# Altium schematic sheet 11_Temp.SchDoc: Level converters
size A3; Organization: Lime Microsystems; Address1: Surrey Tech Centre; Address2: Guildford GU2 7YG; Address3: Surrey; Address4: United Kingdom; Revision: v1.1; SheetNumber: 12; SheetTotal: 12
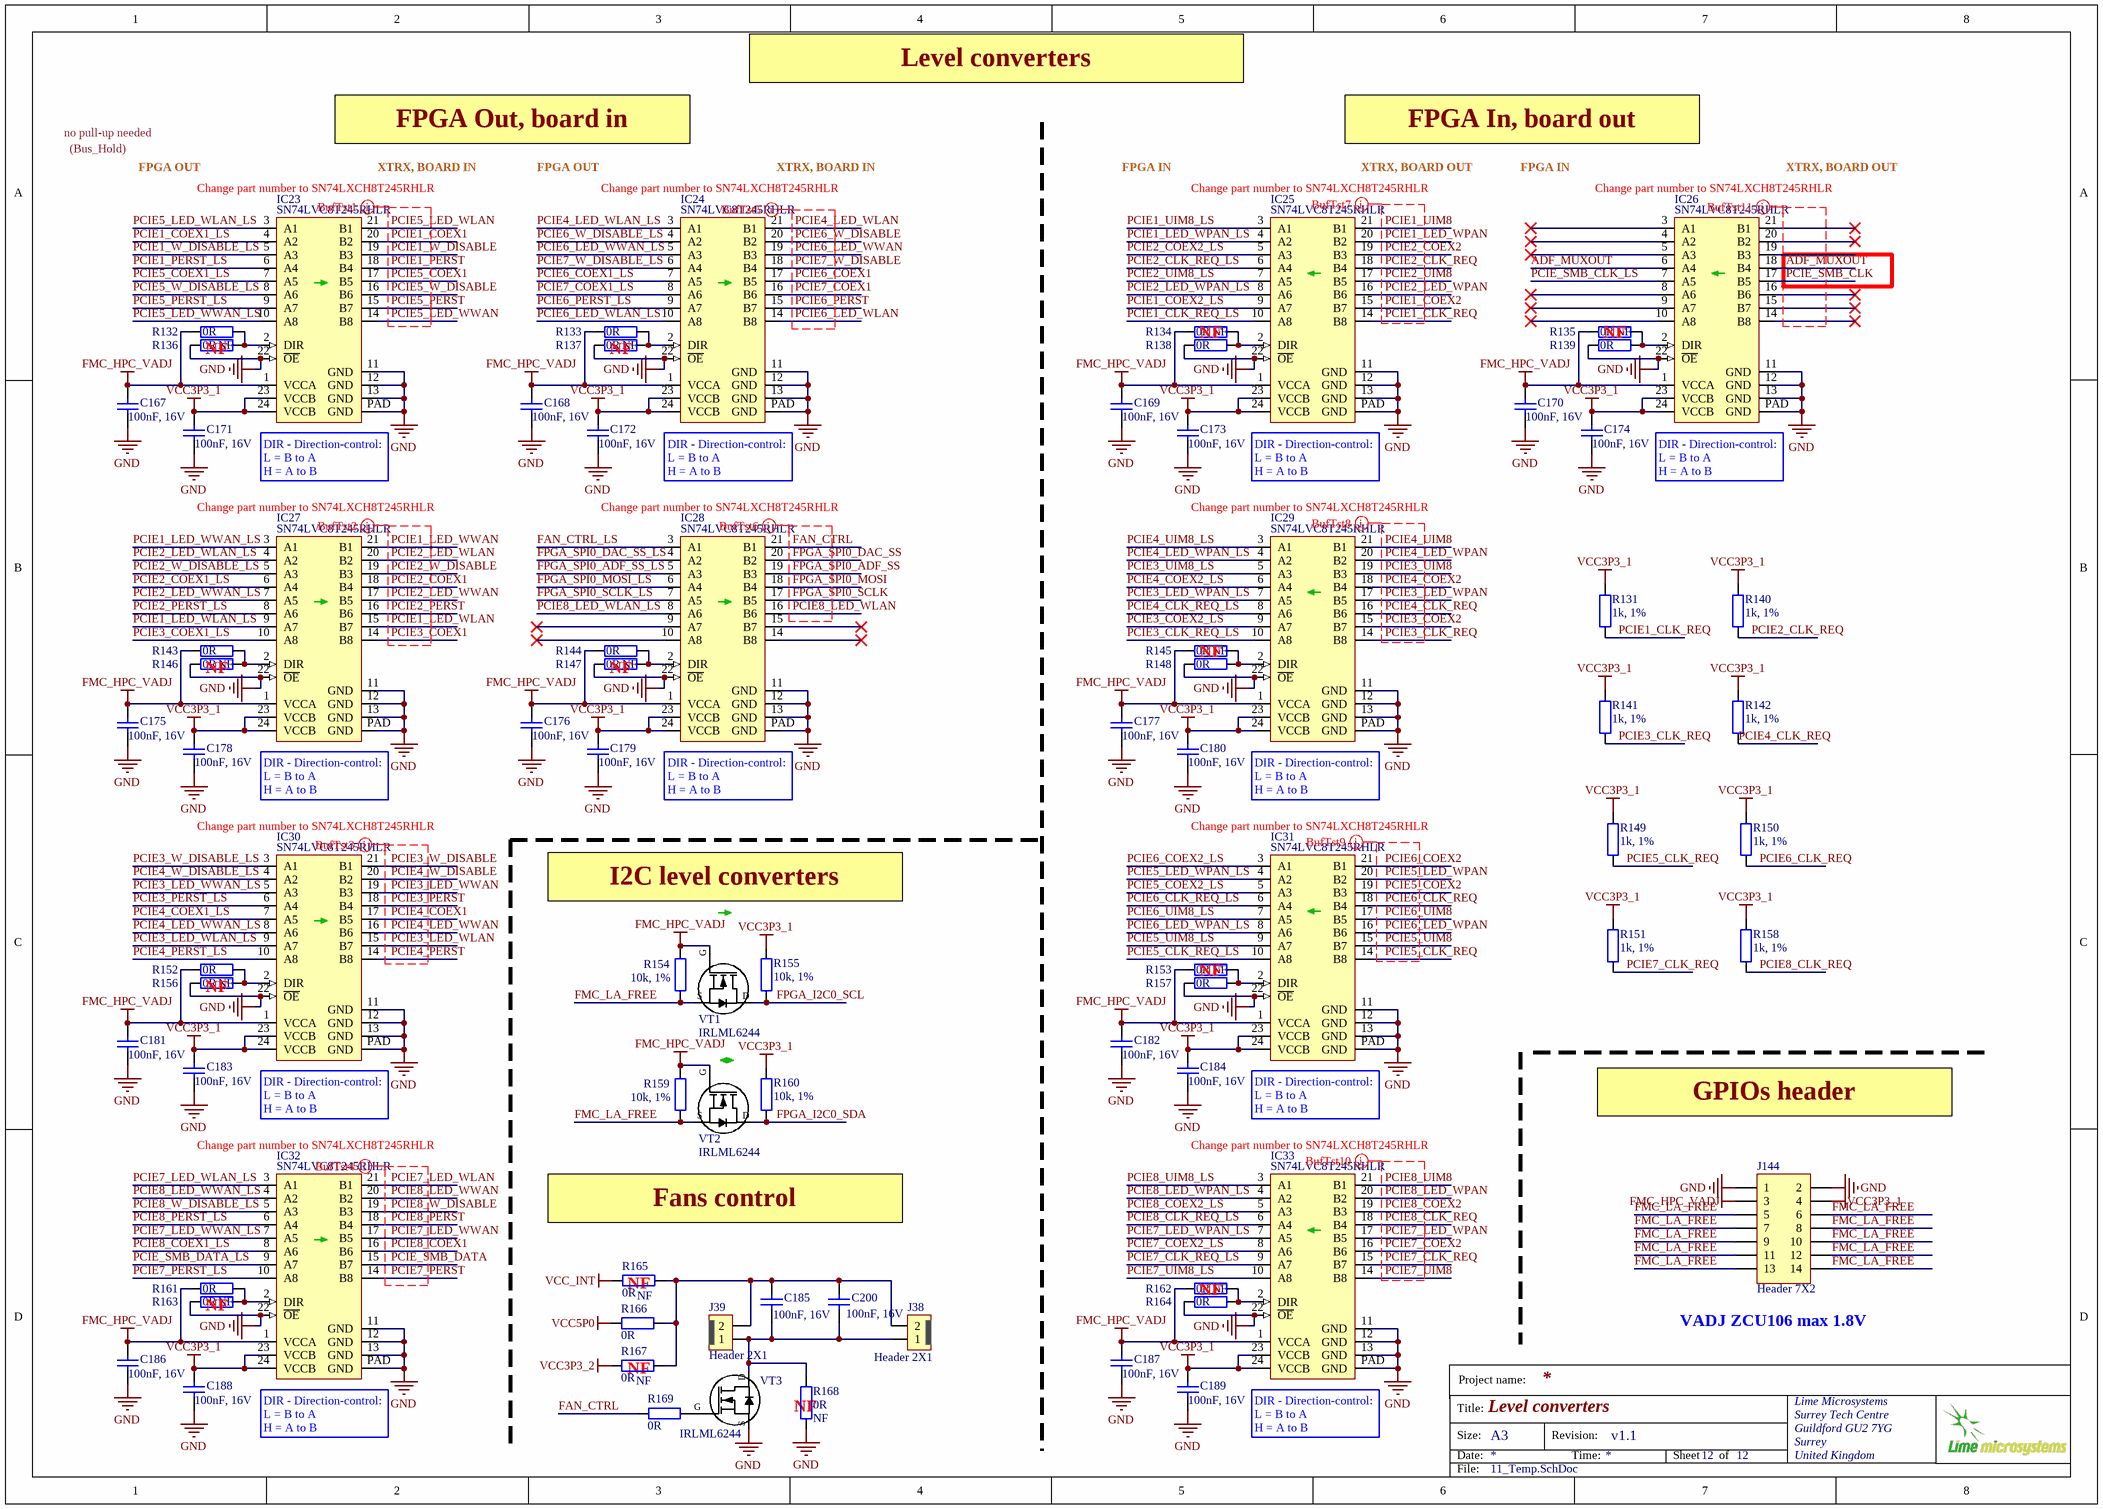
[diagram p0: 11_Temp.SchDoc]

## Parts
C167  100nF, 16V  [CAP0402]
C168  100nF, 16V  [CAP0402]
C169  100nF, 16V  [CAP0402]
C170  100nF, 16V  [CAP0402]
C171  100nF, 16V  [CAP0402]
C172  100nF, 16V  [CAP0402]
C173  100nF, 16V  [CAP0402]
C174  100nF, 16V  [CAP0402]
C175  100nF, 16V  [CAP0402]
C176  100nF, 16V  [CAP0402]
C177  100nF, 16V  [CAP0402]
C178  100nF, 16V  [CAP0402]
C179  100nF, 16V  [CAP0402]
C180  100nF, 16V  [CAP0402]
C181  100nF, 16V  [CAP0402]
C182  100nF, 16V  [CAP0402]
C183  100nF, 16V  [CAP0402]
C184  100nF, 16V  [CAP0402]
C185  100nF, 16V  [CAP0402]
C186  100nF, 16V  [CAP0402]
C187  100nF, 16V  [CAP0402]
C188  100nF, 16V  [CAP0402]
C189  100nF, 16V  [CAP0402]
C200  100nF, 16V  [CAP0402]
IC23  SN74LVC8T245RHLR  [SN74LVC8T245RHLR_24-VQFN_LVL_SHIFTER]
IC24  SN74LVC8T245RHLR  [SN74LVC8T245RHLR_24-VQFN_LVL_SHIFTER]
IC25  SN74LVC8T245RHLR  [SN74LVC8T245RHLR_24-VQFN_LVL_SHIFTER]
IC26  SN74LVC8T245RHLR  [SN74LVC8T245RHLR_24-VQFN_LVL_SHIFTER]
IC27  SN74LVC8T245RHLR  [SN74LVC8T245RHLR_24-VQFN_LVL_SHIFTER]
IC28  SN74LVC8T245RHLR  [SN74LVC8T245RHLR_24-VQFN_LVL_SHIFTER]
IC29  SN74LVC8T245RHLR  [SN74LVC8T245RHLR_24-VQFN_LVL_SHIFTER]
IC30  SN74LVC8T245RHLR  [SN74LVC8T245RHLR_24-VQFN_LVL_SHIFTER]
IC31  SN74LVC8T245RHLR  [SN74LVC8T245RHLR_24-VQFN_LVL_SHIFTER]
IC32  SN74LVC8T245RHLR  [SN74LVC8T245RHLR_24-VQFN_LVL_SHIFTER]
IC33  SN74LVC8T245RHLR  [SN74LVC8T245RHLR_24-VQFN_LVL_SHIFTER]
J38  Header 2X1  [Header1x2_TH_LOCKING]
J39  Header 2X1  [Header1x2_TH_LOCKING]
J144  Header 7X2  [Header7x2_TH]
R131  1k, 1%  [RES0402]
R132  0R  [RES0402]
R133  0R  [RES0402]
R134  0R  Assembly Info: NF  [RES0402]
R135  0R  Assembly Info: NF  [RES0402]
R136  0R  Assembly Info: NF  [RES0402]
R137  0R  Assembly Info: NF  [RES0402]
R138  0R  [RES0402]
R139  0R  [RES0402]
R140  1k, 1%  [RES0402]
R141  1k, 1%  [RES0402]
R142  1k, 1%  [RES0402]
R143  0R  [RES0402]
R144  0R  [RES0402]
R145  0R  Assembly Info: NF  [RES0402]
R146  0R  Assembly Info: NF  [RES0402]
R147  0R  Assembly Info: NF  [RES0402]
R148  0R  [RES0402]
R149  1k, 1%  [RES0402]
R150  1k, 1%  [RES0402]
R151  1k, 1%  [RES0402]
R152  0R  [RES0402]
R153  0R  Assembly Info: NF  [RES0402]
R154  10k, 1%  [RES0402]
R155  10k, 1%  [RES0402]
R156  0R  Assembly Info: NF  [RES0402]
R157  0R  [RES0402]
R158  1k, 1%  [RES0402]
R159  10k, 1%  [RES0402]
R160  10k, 1%  [RES0402]
R161  0R  [RES0402]
R162  0R  Assembly Info: NF  [RES0402]
R163  0R  Assembly Info: NF  [RES0402]
R164  0R  [RES0402]
R165  0R  Assembly Info: NF  [RES0402]
R166  0R  [RES0402]
R167  0R  Assembly Info: NF  [RES0402]
R168  0R  Assembly Info: NF  [RES0402]
R169  0R  [RES0402]
VT1  IRLML6244  [SOT23-3]
VT2  IRLML6244  [SOT23-3]
VT3  IRLML6244  [SOT23-3]

## Nets
FMC_HPC_VADJ: C167.2 C168.2 C169.2 C170.2 C175.2 C176.2 C177.2 C181.2 C182.2 C186.2 C187.2 IC23.1(VCCA) IC24.1(VCCA) IC25.1(VCCA) IC26.1(VCCA) IC27.1(VCCA) IC28.1(VCCA) IC29.1(VCCA) IC30.1(VCCA) IC31.1(VCCA) IC32.1(VCCA) IC33.1(VCCA) J144.3 R132.1 R133.1 R134.1 R135.1 R143.1 R144.1 R145.1 R152.1 R153.1 R154.1 R159.1 R161.1 R162.1 VT1.G VT2.G
GND: C167.1 C168.1 C169.1 C170.1 C171.1 C172.1 C173.1 C174.1 C175.1 C176.1 C177.1 C178.1 C179.1 C180.1 C181.1 C182.1 C183.1 C184.1 C186.1 C187.1 C188.1 C189.1 IC23.11(GND) IC23.12(GND) IC23.13(GND) IC23.22(~{OE}) IC23.PAD(GND) IC24.11(GND) IC24.12(GND) IC24.13(GND) IC24.22(~{OE}) IC24.PAD(GND) IC25.11(GND) IC25.12(GND) IC25.13(GND) IC25.22(~{OE}) IC25.PAD(GND) IC26.11(GND) IC26.12(GND) IC26.13(GND) IC26.22(~{OE}) IC26.PAD(GND) IC27.11(GND) IC27.12(GND) IC27.13(GND) IC27.22(~{OE}) IC27.PAD(GND) IC28.11(GND) IC28.12(GND) IC28.13(GND) IC28.22(~{OE}) IC28.PAD(GND) IC29.11(GND) IC29.12(GND) IC29.13(GND) IC29.22(~{OE}) IC29.PAD(GND) IC30.11(GND) IC30.12(GND) IC30.13(GND) IC30.22(~{OE}) IC30.PAD(GND) IC31.11(GND) IC31.12(GND) IC31.13(GND) IC31.22(~{OE}) IC31.PAD(GND) IC32.11(GND) IC32.12(GND) IC32.13(GND) IC32.22(~{OE}) IC32.PAD(GND) IC33.11(GND) IC33.12(GND) IC33.13(GND) IC33.22(~{OE}) IC33.PAD(GND) J144.1 J144.2 R136.1 R137.1 R138.1 R139.1 R146.1 R147.1 R148.1 R156.1 R157.1 R163.1 R164.1 R168.1 VT3.S
VCC3P3_1: C171.2 C172.2 C173.2 C174.2 C178.2 C179.2 C180.2 C183.2 C184.2 C188.2 C189.2 IC23.23(VCCB) IC23.24(VCCB) IC24.23(VCCB) IC24.24(VCCB) IC25.23(VCCB) IC25.24(VCCB) IC26.23(VCCB) IC26.24(VCCB) IC27.23(VCCB) IC27.24(VCCB) IC28.23(VCCB) IC28.24(VCCB) IC29.23(VCCB) IC29.24(VCCB) IC30.23(VCCB) IC30.24(VCCB) IC31.23(VCCB) IC31.24(VCCB) IC32.23(VCCB) IC32.24(VCCB) IC33.23(VCCB) IC33.24(VCCB) J144.4 R131.2 R140.2 R141.2 R142.2 R149.2 R150.2 R151.2 R155.1 R158.2 R160.1
VCC3P3_2: R167.1
VCC5P0: R166.1
VCC_INT: R165.1
ADF_MUXOUT: IC26.6(A4) IC26.18(B4)
FAN_CTRL: IC28.21(B1) R169.1
FAN_CTRL_LS: IC28.3(A1)
FMC_LA_FREE: J144.5 J144.6 J144.7 J144.8 J144.9 J144.10 J144.11 J144.12 J144.13 J144.14 R154.2 R159.2 VT1.S VT2.S
FPGA_I2C0_SCL: R155.2 VT1.D
FPGA_I2C0_SDA: R160.2 VT2.D
FPGA_SPI0_ADF_SS: IC28.19(B3)
FPGA_SPI0_ADF_SS_LS: IC28.5(A3)
FPGA_SPI0_DAC_SS: IC28.20(B2)
FPGA_SPI0_DAC_SS_LS: IC28.4(A2)
FPGA_SPI0_MOSI: IC28.18(B4)
FPGA_SPI0_MOSI_LS: IC28.6(A4)
FPGA_SPI0_SCLK: IC28.17(B5)
FPGA_SPI0_SCLK_LS: IC28.7(A5)
PCIE1_CLK_REQ: IC25.14(B8) R131.1
PCIE1_CLK_REQ_LS: IC25.10(A8)
PCIE1_COEX1: IC23.20(B2)
PCIE1_COEX1_LS: IC23.4(A2)
PCIE1_COEX2: IC25.15(B7)
PCIE1_COEX2_LS: IC25.9(A7)
PCIE1_LED_WLAN: IC27.15(B7)
PCIE1_LED_WLAN_LS: IC27.9(A7)
PCIE1_LED_WPAN: IC25.20(B2)
PCIE1_LED_WPAN_LS: IC25.4(A2)
PCIE1_LED_WWAN: IC27.21(B1)
PCIE1_LED_WWAN_LS: IC27.3(A1)
PCIE1_PERST: IC23.18(B4)
PCIE1_PERST_LS: IC23.6(A4)
PCIE1_UIM8: IC25.21(B1)
PCIE1_UIM8_LS: IC25.3(A1)
PCIE1_W_DISABLE: IC23.19(B3)
PCIE1_W_DISABLE_LS: IC23.5(A3)
PCIE2_CLK_REQ: IC25.18(B4) R140.1
PCIE2_CLK_REQ_LS: IC25.6(A4)
PCIE2_COEX1: IC27.18(B4)
PCIE2_COEX1_LS: IC27.6(A4)
PCIE2_COEX2: IC25.19(B3)
PCIE2_COEX2_LS: IC25.5(A3)
PCIE2_LED_WLAN: IC27.20(B2)
PCIE2_LED_WLAN_LS: IC27.4(A2)
PCIE2_LED_WPAN: IC25.16(B6)
PCIE2_LED_WPAN_LS: IC25.8(A6)
PCIE2_LED_WWAN: IC27.17(B5)
PCIE2_LED_WWAN_LS: IC27.7(A5)
PCIE2_PERST: IC27.16(B6)
PCIE2_PERST_LS: IC27.8(A6)
PCIE2_UIM8: IC25.17(B5)
PCIE2_UIM8_LS: IC25.7(A5)
PCIE2_W_DISABLE: IC27.19(B3)
PCIE2_W_DISABLE_LS: IC27.5(A3)
PCIE3_CLK_REQ: IC29.14(B8) R141.1
PCIE3_CLK_REQ_LS: IC29.10(A8)
PCIE3_COEX1: IC27.14(B8)
PCIE3_COEX1_LS: IC27.10(A8)
PCIE3_COEX2: IC29.15(B7)
PCIE3_COEX2_LS: IC29.9(A7)
PCIE3_LED_WLAN: IC30.15(B7)
PCIE3_LED_WLAN_LS: IC30.9(A7)
PCIE3_LED_WPAN: IC29.17(B5)
PCIE3_LED_WPAN_LS: IC29.7(A5)
PCIE3_LED_WWAN: IC30.19(B3)
PCIE3_LED_WWAN_LS: IC30.5(A3)
PCIE3_PERST: IC30.18(B4)
PCIE3_PERST_LS: IC30.6(A4)
PCIE3_UIM8: IC29.19(B3)
PCIE3_UIM8_LS: IC29.5(A3)
PCIE3_W_DISABLE: IC30.21(B1)
PCIE3_W_DISABLE_LS: IC30.3(A1)
PCIE4_CLK_REQ: IC29.16(B6) R142.1
PCIE4_CLK_REQ_LS: IC29.8(A6)
PCIE4_COEX1: IC30.17(B5)
PCIE4_COEX1_LS: IC30.7(A5)
PCIE4_COEX2: IC29.18(B4)
PCIE4_COEX2_LS: IC29.6(A4)
PCIE4_LED_WLAN: IC24.21(B1)
PCIE4_LED_WLAN_LS: IC24.3(A1)
PCIE4_LED_WPAN: IC29.20(B2)
PCIE4_LED_WPAN_LS: IC29.4(A2)
PCIE4_LED_WWAN: IC30.16(B6)
PCIE4_LED_WWAN_LS: IC30.8(A6)
PCIE4_PERST: IC30.14(B8)
PCIE4_PERST_LS: IC30.10(A8)
PCIE4_UIM8: IC29.21(B1)
PCIE4_UIM8_LS: IC29.3(A1)
PCIE4_W_DISABLE: IC30.20(B2)
PCIE4_W_DISABLE_LS: IC30.4(A2)
PCIE5_CLK_REQ: IC31.14(B8) R149.1
PCIE5_CLK_REQ_LS: IC31.10(A8)
PCIE5_COEX1: IC23.17(B5)
PCIE5_COEX1_LS: IC23.7(A5)
PCIE5_COEX2: IC31.19(B3)
PCIE5_COEX2_LS: IC31.5(A3)
PCIE5_LED_WLAN: IC23.21(B1)
PCIE5_LED_WLAN_LS: IC23.3(A1)
PCIE5_LED_WPAN: IC31.20(B2)
PCIE5_LED_WPAN_LS: IC31.4(A2)
PCIE5_LED_WWAN: IC23.14(B8)
PCIE5_LED_WWAN_LS: IC23.10(A8)
PCIE5_PERST: IC23.15(B7)
PCIE5_PERST_LS: IC23.9(A7)
PCIE5_UIM8: IC31.15(B7)
PCIE5_UIM8_LS: IC31.9(A7)
PCIE5_W_DISABLE: IC23.16(B6)
PCIE5_W_DISABLE_LS: IC23.8(A6)
PCIE6_CLK_REQ: IC31.18(B4) R150.1
PCIE6_CLK_REQ_LS: IC31.6(A4)
PCIE6_COEX1: IC24.17(B5)
PCIE6_COEX1_LS: IC24.7(A5)
PCIE6_COEX2: IC31.21(B1)
PCIE6_COEX2_LS: IC31.3(A1)
PCIE6_LED_WLAN: IC24.14(B8)
PCIE6_LED_WLAN_LS: IC24.10(A8)
PCIE6_LED_WPAN: IC31.16(B6)
PCIE6_LED_WPAN_LS: IC31.8(A6)
PCIE6_LED_WWAN: IC24.19(B3)
PCIE6_LED_WWAN_LS: IC24.5(A3)
PCIE6_PERST: IC24.15(B7)
PCIE6_PERST_LS: IC24.9(A7)
PCIE6_UIM8: IC31.17(B5)
PCIE6_UIM8_LS: IC31.7(A5)
PCIE6_W_DISABLE: IC24.20(B2)
PCIE6_W_DISABLE_LS: IC24.4(A2)
PCIE7_CLK_REQ: IC33.15(B7) R151.1
PCIE7_CLK_REQ_LS: IC33.9(A7)
PCIE7_COEX1: IC24.16(B6)
PCIE7_COEX1_LS: IC24.8(A6)
PCIE7_COEX2: IC33.16(B6)
PCIE7_COEX2_LS: IC33.8(A6)
PCIE7_LED_WLAN: IC32.21(B1)
PCIE7_LED_WLAN_LS: IC32.3(A1)
PCIE7_LED_WPAN: IC33.17(B5)
PCIE7_LED_WPAN_LS: IC33.7(A5)
PCIE7_LED_WWAN: IC32.17(B5)
PCIE7_LED_WWAN_LS: IC32.7(A5)
PCIE7_PERST: IC32.14(B8)
PCIE7_PERST_LS: IC32.10(A8)
PCIE7_UIM8: IC33.14(B8)
PCIE7_UIM8_LS: IC33.10(A8)
PCIE7_W_DISABLE: IC24.18(B4)
PCIE7_W_DISABLE_LS: IC24.6(A4)
PCIE8_CLK_REQ: IC33.18(B4) R158.1
PCIE8_CLK_REQ_LS: IC33.6(A4)
PCIE8_COEX1: IC32.16(B6)
PCIE8_COEX1_LS: IC32.8(A6)
PCIE8_COEX2: IC33.19(B3)
PCIE8_COEX2_LS: IC33.5(A3)
PCIE8_LED_WLAN: IC28.16(B6)
PCIE8_LED_WLAN_LS: IC28.8(A6)
PCIE8_LED_WPAN: IC33.20(B2)
PCIE8_LED_WPAN_LS: IC33.4(A2)
PCIE8_LED_WWAN: IC32.20(B2)
PCIE8_LED_WWAN_LS: IC32.4(A2)
PCIE8_PERST: IC32.18(B4)
PCIE8_PERST_LS: IC32.6(A4)
PCIE8_UIM8: IC33.21(B1)
PCIE8_UIM8_LS: IC33.3(A1)
PCIE8_W_DISABLE: IC32.19(B3)
PCIE8_W_DISABLE_LS: IC32.5(A3)
PCIE_SMB_CLK: IC26.17(B5)
PCIE_SMB_CLK_LS: IC26.7(A5)
PCIE_SMB_DATA: IC32.15(B7)
PCIE_SMB_DATA_LS: IC32.9(A7)
NetC185_1: C185.1 C200.1 J38.2 J39.2 R165.2 R166.2 R167.2
NetC185_2: C185.2 C200.2 J38.1 J39.1 R168.2 VT3.D
NetIC23_2: IC23.2(DIR) R132.2 R136.2
NetIC24_2: IC24.2(DIR) R133.2 R137.2
NetIC25_2: IC25.2(DIR) R134.2 R138.2
NetIC26_2: IC26.2(DIR) R135.2 R139.2
NetIC27_2: IC27.2(DIR) R143.2 R146.2
NetIC28_2: IC28.2(DIR) R144.2 R147.2
NetIC29_2: IC29.2(DIR) R145.2 R148.2
NetIC30_2: IC30.2(DIR) R152.2 R156.2
NetIC31_2: IC31.2(DIR) R153.2 R157.2
NetIC32_2: IC32.2(DIR) R161.2 R163.2
NetIC33_2: IC33.2(DIR) R162.2 R164.2
NetR169_2: R169.2 VT3.G

Not connected (* = marked no-connect by the designer): IC26 3(A1)* 4(A2)* 5(A3)* 8(A6)* 9(A7)* 10(A8)* 14(B8)* 15(B7)* 16(B6)* 19(B3) 20(B2)* 21(B1)*; IC28 9(A7)* 10(A8)* 14(B8)* 15(B7)*

## Layout directives
net class BufTst1: PCIE1_COEX1, PCIE1_PERST, PCIE1_W_DISABLE, PCIE5_COEX1, PCIE5_LED_WLAN, PCIE5_LED_WWAN, PCIE5_PERST, PCIE5_W_DISABLE
net class BufTst2: PCIE1_LED_WLAN, PCIE1_LED_WWAN, PCIE2_COEX1, PCIE2_LED_WLAN, PCIE2_LED_WWAN, PCIE2_PERST, PCIE2_W_DISABLE, PCIE3_COEX1
net class BufTst3: PCIE3_LED_WLAN, PCIE3_LED_WWAN, PCIE3_PERST, PCIE3_W_DISABLE, PCIE4_COEX1, PCIE4_LED_WWAN, PCIE4_PERST, PCIE4_W_DISABLE
net class BufTst4: PCIE7_LED_WLAN, PCIE7_LED_WWAN, PCIE7_PERST, PCIE8_COEX1, PCIE8_LED_WWAN, PCIE8_PERST, PCIE8_W_DISABLE, PCIE_SMB_DATA
net class BufTst6: FAN_CTRL, FPGA_SPI0_ADF_SS, FPGA_SPI0_DAC_SS, FPGA_SPI0_MOSI, FPGA_SPI0_SCLK, PCIE8_LED_WLAN
net class BufTst5: PCIE4_LED_WLAN, PCIE6_COEX1, PCIE6_LED_WLAN, PCIE6_LED_WWAN, PCIE6_PERST, PCIE6_W_DISABLE, PCIE7_COEX1, PCIE7_W_DISABLE
net class BufTst7: PCIE1_CLK_REQ, PCIE1_COEX2, PCIE1_LED_WPAN, PCIE1_UIM8, PCIE2_CLK_REQ, PCIE2_COEX2, PCIE2_LED_WPAN, PCIE2_UIM8
net class BufTst8: PCIE3_CLK_REQ, PCIE3_COEX2, PCIE3_LED_WPAN, PCIE3_UIM8, PCIE4_CLK_REQ, PCIE4_COEX2, PCIE4_LED_WPAN, PCIE4_UIM8
net class BufTst9: PCIE5_CLK_REQ, PCIE5_COEX2, PCIE5_LED_WPAN, PCIE5_UIM8, PCIE6_CLK_REQ, PCIE6_COEX2, PCIE6_LED_WPAN, PCIE6_UIM8
net class BufTst10: PCIE7_CLK_REQ, PCIE7_COEX2, PCIE7_LED_WPAN, PCIE7_UIM8, PCIE8_CLK_REQ, PCIE8_COEX2, PCIE8_LED_WPAN, PCIE8_UIM8
net class BufTst11: ADF_MUXOUT, PCIE_SMB_CLK

## Notes on the sheet
- Level converters
- no pull-up needed
- (Bus_Hold)
- FPGA OUT
- FPGA Out, board in
- XTRX, BOARD IN
- FPGA IN
- FPGA In, board out
- (near IC25) XTRX, BOARD OUT
- XTRX, BOARD OUT
- (near IC23) Change part number to SN74LXCH8T245RHLR
- (near IC24) Change part number to SN74LXCH8T245RHLR
- (near IC25) Change part number to SN74LXCH8T245RHLR
- (near IC26) Change part number to SN74LXCH8T245RHLR
- (near R136) NF
- (near R137) NF
- NF
- (near IC27) Change part number to SN74LXCH8T245RHLR
- (near IC23) DIR - Direction-control:
  L = B to A
  H = A to B
- (near IC28) Change part number to SN74LXCH8T245RHLR
- (near IC24) DIR - Direction-control:
  L = B to A
  H = A to B
- (near IC29) Change part number to SN74LXCH8T245RHLR
- (near IC25) DIR - Direction-control:
  L = B to A
  H = A to B
- (near IC26) DIR - Direction-control:
  L = B to A
  H = A to B
- (near R146) NF
- (near R147) NF
- (near IC30) Change part number to SN74LXCH8T245RHLR
- (near IC27) DIR - Direction-control:
  L = B to A
  H = A to B
- (near IC28) DIR - Direction-control:
  L = B to A
  H = A to B
- (near IC31) Change part number to SN74LXCH8T245RHLR
- (near IC29) DIR - Direction-control:
  L = B to A
  H = A to B
- I2C level converters
- (near R156) NF
- (near IC30) DIR - Direction-control:
  L = B to A
  H = A to B
- (near IC31) DIR - Direction-control:
  L = B to A
  H = A to B
- GPIOs header
- (near IC32) Change part number to SN74LXCH8T245RHLR
- (near IC33) Change part number to SN74LXCH8T245RHLR
- Fans control
- (near R163) NF
- (near R165) NF
- (near J144) VADJ ZCU106 max 1.8V
- (near R167) NF
- (near IC32) DIR - Direction-control:
  L = B to A
  H = A to B
- (near R168) NF
- (near IC33) DIR - Direction-control:
  L = B to A
  H = A to B
- Project name:
- Title:
- Size:
- Date:
- A3
- Revision:
- Time:
- Sheet
- of
- File:

## Library data of the parts
C167-C184 C186-C189 = Cap_0603: Manufacturer Part Number 1: GRM155R71C104KA88D; Part Description: 0.10µF ±10% 16V X7R Ceramic Capacitor -55°C ~ 125°C Surface Mount, MLCC 0402 (1005 Metric) 0.039" L x 0.020" W (1.00mm x 0.50mm); Brand: Murata Electronics; Tolerance: 10 %; Type: General Purpose MLCC; Capacitance: 0.1 uF; Temperature Coefficient / Code: +/- 15 %; Case Height: 0.5 mm; Case Length: 1 mm; Dielectric: X7R; Supplier 1: Mouser; Supplier Part Number 1: 81-GRM155R71C104KA88; Case Code - in: 0402; Manufacturer: Murata Electronics; Category: Multilayer Ceramic Capacitors MLCC - SMD/SMT; Voltage Rating DC: 16 V; Value: 100nF, 16V; Case Code - mm: 1005; Case Width: 0.5 mm; Maximum Operating Temperature: + 125 C; Minimum Operating Temperature: - 55 C; Minimum Order Quantity: 1; Operating Temperature Range: - 55 C to + 125 C; Package / Case: 0402 (1005 metric); Packaging: Reel; Product: General Type MLCCs; Product Category: Low & Medium Capacitance SMD Ceramic Chip Capacitors; Reeling: True; RoHS - Mouser: Y; RoHS: RoHS Compliant; Series: GRM; Standard Pack Qty: 10000; Termination Style: SMD/SMT
C185 C200 = Cap_0603: Manufacturer Part Number 1: GRM155R71C104KA88D; Part Description: 0.10µF ±10% 16V Ceramic Capacitor X7R 0402 (1005 Metric); Brand: Murata Electronics; Tolerance: 10 %; Type: General Purpose MLCC; Capacitance: 0.1 uF; Temperature Coefficient / Code: +/- 15 %; Case Height: 0.5 mm; Case Length: 1 mm; Dielectric: X7R; Supplier 1: Mouser; Supplier Part Number 1: 81-GRM155R71C104KA88; Case Code - in: 0402; Manufacturer: Murata Electronics; Category: Multilayer Ceramic Capacitors MLCC - SMD/SMT; Voltage Rating DC: 16 V; Value: 100nF, 16V; Manufacturer Part Number: GRM155R71C104KA88D; Case Code - mm: 1005; Case Width: 0.5 mm; Maximum Operating Temperature: + 125 C; Minimum Operating Temperature: - 55 C; Minimum Order Quantity: 1; Operating Temperature Range: - 55 C to + 125 C; Package / Case: 0402 (1005 metric); Packaging: Reel; Product: General Type MLCCs; Product Category: Low & Medium Capacitance SMD Ceramic Chip Capacitors; Reeling: True; RoHS - Mouser: Y; RoHS: RoHS Compliant; Series: GRM; Standard Pack Qty: 10000; Termination Style: SMD/SMT
IC23-IC33 = SN74LVC8T245RHLR_LVL_SHIFTER: Manufacturer: Texas Instruments; Part Description: Voltage Level Translator Bidirectional 1 Circuit 8 Channel  24-VQFN (5.5x3.5); Direction: Bidirectional; Number of Elements: 1; Propagation Delay: 4.3ns; Max Supply Voltage: 5.5V; Min Supply Voltage: 1.65V; Number of Inputs: 8; Output Current: 32mA; Logic Function: Translator; Turn-On Delay Time: 4.2ns; Data Rate: 500Mbps; Polarity: Non-Inverting; High Level Output Current: -32mA; Quiescent Current: 15uA; Supplier 1: Digi-Key; Manufacturer Part Number 1: SN74LVC8T245RHLR; Stock 1: 27446; Pricing 1: 1=1,38000, 10=1,23700, 100=0,96420, 500=0,79650 (USD); RoHS: Yes; Mount: Surface Mount; Case/Package: VQFN; Number of Pins: 24; Weight: 0.001767oz; Contact Plating: Gold; Min Operating Temperature: -40°C; Max Operating Temperature: 85°C; Packaging: Tape and Reel; Package Quantity: 1; Number of Channels: 8; Number of Bits: 8; Low Level Output Current: 32mA; Number of Outputs: 8; Nominal Supply Current: 15uA; Length: 5.65mm; Height: 0.95mm; Width: 3.65mm; Radiation Hardening: No; REACH SVHC: No SVHC; Lead Free: Lead Free; ComponentLink1URL: https://datasheet.ciiva.com/14315/sces584a-14315712.pdf?src-supplier=Farnell; ComponentLink1Description: https://datasheet.ciiva.com/14315/sces584a-14315712.pdf?src-supplier=Farnell; ComponentLink2URL: https://datasheet.ciiva.com/1628/sn74lvc8t245-1628896.pdf?src-supplier=Newark; ComponentLink2Description: https://datasheet.ciiva.com/1628/sn74lvc8t245-1628896.pdf?src-supplier=Newark; ComponentLink3URL: https://datasheet.ciiva.com/15086/getdatasheetpartid-245666-15086422.pdf?src-supplier=Verical; ComponentLink3Description: https://datasheet.ciiva.com/15086/getdatasheetpartid-245666-15086422.pdf?src-supplier=Verical; ComponentLink4URL: https://datasheet.ciiva.com/1508/1882283-1508817.pdf?src-supplier=Element14; ComponentLink4Description: https://datasheet.ciiva.com/1508/1882283-1508817.pdf?src-supplier=Element14; ComponentLink5URL: https://datasheet.ciiva.com/1508/1831204-1508707.pdf?src-supplier=Element14; ComponentLink5Description: https://datasheet.ciiva.com/1508/1831204-1508707.pdf?src-supplier=Element14; ComponentLink6URL: https://datasheet.ciiva.com/1899/sn74lvc8t245-1899443.pdf?src-supplier=Digi-Key; ComponentLink6Description: https://datasheet.ciiva.com/1899/sn74lvc8t245-1899443.pdf?src-supplier=Digi-Key; ComponentLink7URL: https://datasheet.ciiva.com/1899/sn74lvc8t245-1899445.pdf?src-supplier=Digi-Key; ComponentLink7Description: https://datasheet.ciiva.com/1899/sn74lvc8t245-1899445.pdf?src-supplier=Digi-Key; ComponentLink8URL: https://datasheet.ciiva.com/1508/1831204-1508706.pdf?src-supplier=Element14; ComponentLink8Description: https://datasheet.ciiva.com/1508/1831204-1508706.pdf?src-supplier=Element14; ComponentLink9URL: https://datasheet.ciiva.com/1899/sn74lvc8t245-1899444.pdf?src-supplier=Digi-Key; ComponentLink9Description: https://datasheet.ciiva.com/1899/sn74lvc8t245-1899444.pdf?src-supplier=Digi-Key; ComponentLink10URL: https://datasheet.ciiva.com/14298/sn74lvc8t245-14298297.pdf?src-supplier=Avnet; ComponentLink10Description: https://datasheet.ciiva.com/14298/sn74lvc8t245-14298297.pdf?src-supplier=Avnet; ComponentLink11URL: https://datasheet.ciiva.com/14298/sn74lvc8t245-14298299.pdf?src-supplier=Avnet; ComponentLink11Description: https://datasheet.ciiva.com/14298/sn74lvc8t245-14298299.pdf?src-supplier=Avnet; ComponentLink12URL: https://datasheet.ciiva.com/46395/1882283-46395885.pdf?src-supplier=Element14; ComponentLink12Description: https://datasheet.ciiva.com/46395/1882283-46395885.pdf?src-supplier=Element14; ComponentLink13URL: https://datasheet.ciiva.com/25970/sn74lvc8t245-25970223.pdf?src-supplier=Avnet+Europe; ComponentLink13Description: https://datasheet.ciiva.com/25970/sn74lvc8t245-25970223.pdf?src-supplier=Avnet+Europe; ComponentLink14URL: https://datasheet.ciiva.com/48703/001073805-da-01-en-ic-bus-trans-sn74lvc8t245rhlr-qfn-24-tid-48703067.pdf?src-supplier=Conrad; ComponentLink14Description: https://datasheet.ciiva.com/48703/001073805-da-01-en-ic-bus-trans-sn74lvc8t245rhlr-qfn-24-tid-48703067.pdf?src-supplier=Conrad; Supplier Part Number 1: 296-18595-1-ND
J38 J39 = Header 2X1 LOCK: Manufacturer 1: Molex; Part Description: Connector Header Through Hole 2 position 0.100" (2.54mm); Supplier 1: Digi-Key; Supplier Part Number 1: WM19460-ND; Manufacturer Part Number: 22-11-2026; Stock 1: 0; RoHS: Yes; ComponentLink1URL: https://datasheet.ciiva.com/5156/022045042-sd-206842-5156139.pdf?src-supplier=Mouser; ComponentLink1Description: https://datasheet.ciiva.com/5156/022045042-sd-206842-5156139.pdf?src-supplier=Mouser; ComponentLink2URL: https://datasheet.ciiva.com/30212/022232051-sd-30212109.pdf?src-supplier=Onlinecomponents.com; ComponentLink2Description: https://datasheet.ciiva.com/30212/022232051-sd-30212109.pdf?src-supplier=Onlinecomponents.com; Manufacturer: Molex; Manufacturer Part Number 1: 22-11-2026
J144 = Header 7X2: Header, 7-Pin, Dual row; Manufacturer 1: Adam Equipment; Manufacturer Part Number: PH2-14-UA; Part Description: Connector Header Through Hole 14 position 0.100" (2.54mm); Number of Positions: 14; Pitch: 2.54mm; Supplier 1: Digi-Key; Supplier Part Number 1: 2057-PH2-14-UA-ND; Stock 1: 11861; Pricing 1: 1=0,24000, 10=0,19900, 100=0,15340, 500=0,12976, 1000=0,10617, 5000=0,09437, 10000=0,08553 (USD); RoHS: Yes; Termination: Solder; Lead Free: Lead Free; ComponentLink1URL: https://datasheet.ciiva.com/16397/ph2-14-ua-16397187.pdf?src-supplier=Future+Electronics; ComponentLink1Description: https://datasheet.ciiva.com/16397/ph2-14-ua-16397187.pdf?src-supplier=Future+Electronics; Manufacturer: Adam Equipment; Manufacturer Part Number 1: PH2-14-UA
R131 R140-R142 R149-R151 R158 = Res_0402: Manufacturer: Stackpole Electronics Inc; Manufacturer Part Number 1: RMCF0402FT1K00; Part Description: RES SMD 1K OHM 1% 1/16W 0402; Temperature Coefficient: ±100ppm/°C; Power (Watts): 0.063W, 1/16W; Value: 1k, 1%; Supplier 1: Digi-Key; Supplier Part Number 1: RMCF0402FT1K00TR-ND; Resistance (Ohms): 1k; Packaging: Tape & Reel (TR); Category: Resistors; RoHS: RoHS Compliant; Tolerance: ±1%; Height: 0.016" (0.40mm); Number of Terminations: 2; Package / Case: 0402 (1005 Metric); Operating Temperature: -55°C ~ 155°C; Features: -; Composition: Thick Film; Supplier Device Package: 0402; Size / Dimension: 0.039" L x 0.020" W (1.00mm x 0.50mm)
R132-R139 R143-R148 R152 R153 R156 R157 R161-R169 = Res_0402: Manufacturer Part Number 1: RC0402JR-070RL; Manufacturer: Yageo; Part Description: RES SMD 0.0OHM JUMPER 1/16W 0402; Resistance (Ohms): 0.0; Tolerance: Jumper; Power (Watts): 0.063W, 1/16W; Value: 0R; Supplier 1: Digi-Key; Supplier Part Number 1: 311-0.0JRTR-ND; Category: Resistors; Temperature Coefficient: -; Features: Moisture Resistant; Supplier Device Package: 0402; Height: 0.016" (0.40mm); Package / Case: 0402 (1005 Metric); Operating Temperature: -55°C ~ 155°C; Size / Dimension: 0.039" L x 0.020" W (1.00mm x 0.50mm); Composition: Thick Film; Packaging: Tape & Reel (TR); Number of Terminations: 2; RoHS: RoHS Compliant
R154 R155 R159 R160 = Res_0402: Manufacturer: Yageo; Manufacturer Part Number 1: RC0402FR-0710KL; Part Description: RES SMD 10K OHM 1% 1/16W 0402; Temperature Coefficient: ±100ppm/°C; Power (Watts): 0.063W, 1/16W; Value: 10k, 1%; Supplier 1: Digi-Key; Supplier Part Number 1: 311-10.0KLRTR-ND; Resistance (Ohms): 10k; Packaging: Tape & Reel (TR); RoHS: RoHS Compliant; Package / Case: 0402 (1005 Metric); Tolerance: ±1%; Operating Temperature: -55°C ~ 155°C; Size / Dimension: 0.039" L x 0.020" W (1.00mm x 0.50mm); Number of Terminations: 2; Category: Resistors; Height: 0.016" (0.40mm); Supplier Device Package: 0402; Features: Moisture Resistant; Composition: Thick Film
VT1-VT3 = NDS331N: Manufacturer: Infineon Technologies; Manufacturer Part Number 1: IRLML6244TRPBF; Part Description: N-Channel 20V 6.3A (Ta) 1.3W (Ta) Surface Mount Micro3™/SOT-23; FET Type: N-Channel; Current - Continuous Drain (Id) @ 25°C: 6.3A (Ta); Drive Voltage (Max Rds On,  Min Rds On): 2.5V, 4.5V; Vgs(th) (Max) @ Id: 1.1V @ 10µA; Gate Charge (Qg) (Max) @ Vgs: 8.9nC @ 4.5V; Input Capacitance (Ciss) (Max) @ Vds: 700pF @ 16V; Vgs (Max): ±12V; Power Dissipation (Max): 1.3W (Ta); Rds On (Max) @ Id, Vgs: 21 mOhm @ 6.3A, 4.5V; Supplier 1: Digi-Key; Supplier Part Number 1: IRLML6244TRPBFTR-ND; RoHS: RoHS Compliant; Category: Discrete Semiconductor Products; Stock 1: 21000; Pricing 1: 3000=0.09979 (USD); Packaging: Tape & Reel (TR); Part Status: Active; Technology: MOSFET (Metal Oxide); FET Feature: -; Operating Temperature: -55°C ~ 150°C (TJ); Mounting Type: Surface Mount; Supplier Device Package: Micro3™/SOT-23; Package / Case: TO-236-3, SC-59, SOT-23-3; ComponentLink1URL: https://www.infineon.com/dgdl/irlml6244pbf.pdf?fileId=5546d462533600a4015356686fed261f; ComponentLink1Description: https://www.infineon.com/dgdl/irlml6244pbf.pdf?fileId=5546d462533600a4015356686fed261f